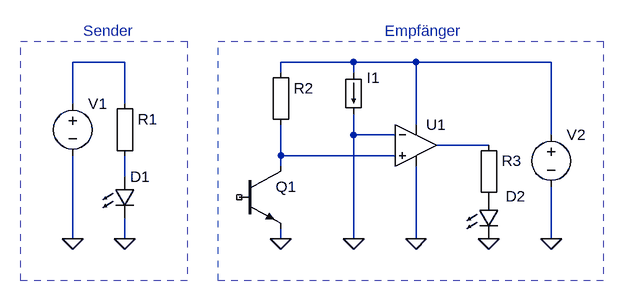
[diagram p0: schematic Recherche.asc]
Recherche.asc, the LTspice schematic file:
Version 4
SHEET 1 984 680
WIRE 176 -80 96 -80
WIRE 528 -80 416 -80
WIRE 624 -80 528 -80
WIRE 832 -80 624 -80
WIRE 416 -64 416 -80
WIRE 528 -64 528 -80
WIRE 96 -16 96 -80
WIRE 176 -16 176 -80
WIRE 624 16 624 -80
WIRE 528 32 528 0
WIRE 592 32 528 32
WIRE 832 32 832 -80
WIRE 736 48 656 48
WIRE 416 64 416 16
WIRE 592 64 416 64
WIRE 416 80 416 64
WIRE 176 96 176 64
WIRE 96 192 96 64
WIRE 176 192 176 160
WIRE 416 192 416 176
WIRE 528 192 528 32
WIRE 624 192 624 80
WIRE 832 192 832 112
FLAG 176 192 0
FLAG 96 192 0
FLAG 416 192 0
FLAG 528 192 0
FLAG 624 192 0
FLAG 832 192 0
FLAG 736 192 0
SYMBOL voltage 96 -32 R0
SYMATTR InstName V1
SYMATTR Value ""
SYMBOL voltage 832 16 R0
WINDOW 123 0 0 Left 0
WINDOW 39 0 0 Left 0
SYMATTR InstName V2
SYMATTR Value ""
SYMBOL Misc\\EuropeanResistor 160 -32 R0
SYMATTR InstName R1
SYMATTR Value ""
SYMBOL Misc\\EuropeanResistor 400 -80 R0
SYMATTR InstName R2
SYMATTR Value ""
SYMBOL Misc\\EuropeanResistor 720 32 R0
SYMATTR InstName R3
SYMATTR Value ""
SYMBOL LED 160 96 R0
SYMATTR InstName D1
SYMATTR Value ""
SYMBOL LED 720 128 R0
WINDOW 0 42 -2 Left 2
SYMATTR InstName D2
SYMATTR Value ""
SYMBOL npn 352 80 R0
SYMATTR InstName Q1
SYMATTR Value ""
SYMBOL load 512 -64 R0
SYMATTR InstName I1
SYMATTR Value ""
SYMBOL Opamps\\opamp2 624 -16 R0
SYMATTR InstName U1
SYMATTR Value ""
TEXT 112 -128 Left 2 ;Sender
TEXT 576 -128 Left 2 ;Empfänger
RECTANGLE Normal 272 256 16 -112 2
RECTANGLE Normal 912 256 320 -112 2

The netlist it stands for:
* Recherche.asc
V1 N001 0
V2 N002 0
R1 N001 N005
R2 N002 N004
R3 N003 P001
D1 N005 0
D2 P001 0
Q1 N004 NC_01 0 0
I1 N002 0
XU1 N004 0 N002 0 N003 opamp2  ; pins In+ In- V+ V- OUT
.model D D
.lib standard.dio
.model NPN NPN
.model PNP PNP
.lib standard.bjt
* Sender
* Empfänger
.backanno
.end